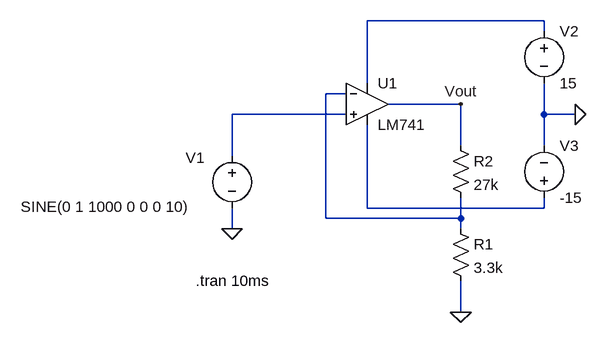
[diagram p0: schematic noninverting_opa.asc]
noninverting_opa.asc, the LTspice schematic file:
Version 4
SHEET 1 880 680
WIRE 480 32 208 32
WIRE 480 48 480 32
WIRE 208 128 208 32
WIRE 176 144 144 144
WIRE 352 160 240 160
WIRE 176 176 0 176
WIRE 480 176 480 128
WIRE 528 176 480 176
WIRE 352 224 352 160
WIRE 480 224 480 176
WIRE 0 240 0 176
WIRE 208 320 208 192
WIRE 480 320 480 304
WIRE 480 320 208 320
WIRE 144 336 144 144
WIRE 352 336 352 304
WIRE 352 336 144 336
WIRE 0 352 0 320
WIRE 352 352 352 336
WIRE 352 480 352 432
FLAG 528 176 0
FLAG 352 160 Vout
FLAG 0 352 0
FLAG 352 480 0
SYMBOL OpAmps\\LM741 208 96 R0
SYMATTR InstName U1
SYMBOL voltage 0 224 R0
WINDOW 3 -325 94 Left 2
WINDOW 123 0 0 Left 0
WINDOW 39 0 0 Left 0
WINDOW 0 -71 19 Left 2
SYMATTR Value SINE(0 1 1000 0 0 0 10)
SYMATTR InstName V1
SYMBOL voltage 480 32 R0
WINDOW 123 0 0 Left 0
WINDOW 39 0 0 Left 0
SYMATTR InstName V2
SYMATTR Value 15
SYMBOL voltage 480 320 M180
WINDOW 0 24 96 Left 2
WINDOW 3 24 16 Left 2
WINDOW 123 0 0 Left 0
WINDOW 39 0 0 Left 0
SYMATTR InstName V3
SYMATTR Value -15
SYMBOL res 336 336 R0
SYMATTR InstName R1
SYMATTR Value 3.3k
SYMBOL res 336 208 R0
SYMATTR InstName R2
SYMATTR Value 27k
TEXT -56 432 Left 2 !.tran 10ms

The netlist it stands for:
* noninverting_opa.asc
XU1 N003 N002 N001 N004 Vout LM741  ; pins In+ In- V+ V- OUT
V1 N003 0 SINE(0 1 1000 0 0 0 10)
V2 N001 0 15
V3 N004 0 -15
R1 N002 0 3.3k
R2 Vout N002 27k
.tran 10ms
.lib LM741.lib
.backanno
.end